# Altium schematic sheet button_panel.SchDoc
size 297 x 209 mm; DrawnBy: Supun; Engineer: Supun; Organization: C3
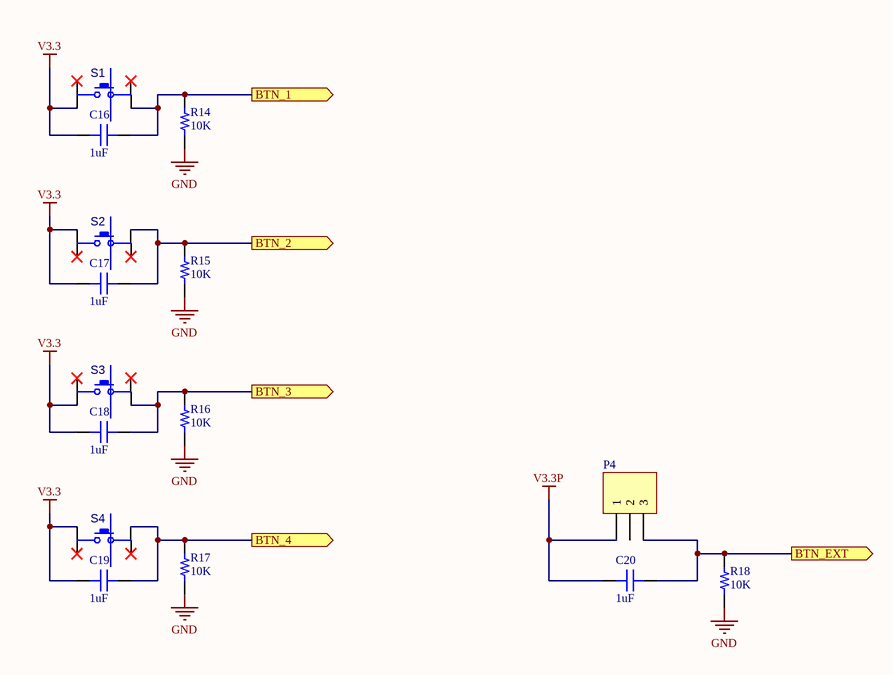
[diagram p0: button_panel.SchDoc]

## Parts
C16  1uF  [CAP 0603_1608]
C17  1uF  [CAP 0603_1608]
C18  1uF  [CAP 0603_1608]
C19  1uF  [CAP 0603_1608]
C20  1uF  [CAP 0603_1608]
P4  (no value)  [TEConn_EP2.5_1x3]
R14  10K  [RES 0603_1608]
R15  10K  [RES 0603_1608]
R16  10K  [RES 0603_1608]
R17  10K  [RES 0603_1608]
R18  10K  [RES 0603_1608]
S1  SPST-NO  [C&K PTS125 H7.3]  (value not drawn)
S2  SPST-NO  [C&K PTS125 H7.3]  (value not drawn)
S3  SPST-NO  [C&K PTS125 H7.3]  (value not drawn)
S4  SPST-NO  [C&K PTS125 H7.3]  (value not drawn)

## Ports
BTN_1 (out), BTN_2 (out), BTN_3 (out), BTN_4 (out), BTN_EXT (out)

## Nets
GND: R14.2 R15.2 R16.2 R17.2 R18.2
V3.3: C16.2 C17.2 C18.2 C19.2 S1.2(P3) S2.1(P1) S3.2(P3) S4.1(P1)
V3.3P: C20.2 P4.1
BTN_1: C16.1 R14.1 S1.4(P2) ; port BTN_1
BTN_2: C17.1 R15.1 S2.3(P4) ; port BTN_2
BTN_3: C18.1 R16.1 S3.4(P2) ; port BTN_3
BTN_4: C19.1 R17.1 S4.3(P4) ; port BTN_4
BTN_EXT: C20.1 P4.3 R18.1 ; port BTN_EXT

Not connected (* = marked no-connect by the designer): P4 2; S1 1(P1)* 3(P4)*; S2 2(P3)* 4(P2)*; S3 1(P1)* 3(P4)*; S4 2(P3)* 4(P2)*

## Notes on the sheet
- Title
- Size:
- Date:
- A4
- Number:
- Time:
- Revision:
- Sheet
- of
- File:

## Library data of the parts
C16-C20 = Capacitor: SMT Capacitor; MF: Murata; MP: GRT188R61H105KE13D; Value: 1uF; Link: https://www.mouser.com/ProductDetail/Murata-Electronics/GRT188R61H105KE13D?qs=drgMNd%252BkGPNIxxtJByMGCg%3D%3D
P4 = Header 3H: Header, 3-Pin, Right Angle; MF: TE Connectivity; MP: 1744426-3; LatestRevisionDate: 17-Jul-2002; LatestRevisionNote: Re-released for DXP Platform.; Publisher: Altium Limited; Link: https://www.mouser.com/ProductDetail/TE-Connectivity-AMP/1744426-3?qs=IGPQaF7TU6sEhFWrzjofqw%3D%3D
R14-R18 = Resistor: SMT Resistor; MF: YAGEO; MP: AC0603FR-0710KL; Value: 10K; Link: https://www.mouser.com/ProductDetail/YAGEO/AC0603FR-0710KL?qs=UoPT7wUmgYKz3zh0UDMA4Q%3D%3D
S1-S4 = SPST-NO 4 PIN ALT1: SWITCH, PUSH BUTTON, TACTILE, SMD, SPDT, 6X6X7mm; MF: C&K; DESC: DESCRIPTION; MP: PTS125SJM73SMTR2LFS; Value: SPST-NO; ASSEMBLY: ASSEMBLY; PRICE: PRICE; Link: https://www.mouser.com/ProductDetail/CK/PTS125SJM73SMTR2LFS?qs=IL6XaBr%252B7X%252BXH%2FUFAqS8WQ%3D%3D